# EAGLE design pedal-box-board-testing-manufactured-2016-10-21 (EAGLE 7.6.0)
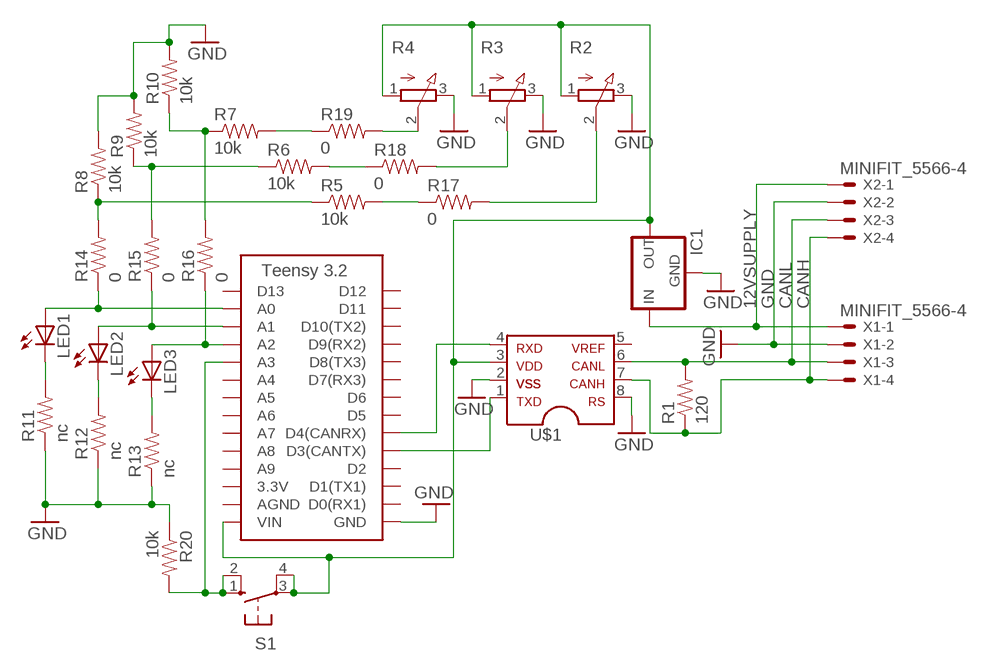
[diagram p0: schematic, sheet 1]

## Parts
IC1  5V_REGULATOR_L7805SWITCHING  [TO-220]
LED1  LED-5MM  [LED-5MM]
LED2  LED-5MM  [LED-5MM]
LED3  LED-5MM  [LED-5MM]
R1  120  RESISTORAXIAL-0.3  [AXIAL-0.3]
R2  3RP/1610N  [3RP/1610N]
R3  3RP/1610N  [3RP/1610N]
R4  3RP/1610N  [3RP/1610N]
R5  10k  RESISTOREZ  [AXIAL-0.3EZ]
R6  10k  RESISTOREZ  [AXIAL-0.3EZ]
R7  10k  RESISTOREZ  [AXIAL-0.3EZ]
R8  10k  RESISTOREZ  [AXIAL-0.3EZ]
R9  10k  RESISTOREZ  [AXIAL-0.3EZ]
R10  10k  RESISTOREZ  [AXIAL-0.3EZ]
R11  nc  RESISTOREZ  [AXIAL-0.3EZ]
R12  nc  RESISTOREZ  [AXIAL-0.3EZ]
R13  nc  RESISTOREZ  [AXIAL-0.3EZ]
R14  0  RESISTOREZ  [AXIAL-0.3EZ]
R15  0  RESISTOREZ  [AXIAL-0.3EZ]
R16  0  RESISTOREZ  [AXIAL-0.3EZ]
R17  0  RESISTOREZ  [AXIAL-0.3EZ]
R18  0  RESISTOREZ  [AXIAL-0.3EZ]
R19  0  RESISTOREZ  [AXIAL-0.3EZ]
R20  10k  RESISTOREZ  [AXIAL-0.3EZ]
S1  BTN_10-XX  [B3F-10XX]
U$1  MCP2551  [SOIC-08]
U$2  TEENSY_3.2_SIMPLE  [TEENSY_3.2_SIMPLE]
X1  MINIFIT_5566-4  [MINIFIT_5566-4]
X2  MINIFIT_5566-4  [MINIFIT_5566-4]

## Nets
12VSUPPLY: IC1.1(IN) X1.1 X2.1
CANH: R1.P$1 U$1.7 X1.4 X2.4
CANL: R1.P$2 U$1.6 X1.3 X2.3
GND: IC1.2(GND) R2.3(E) R3.3(E) R4.3(E) R8.P$2 R9.P$2 R10.P$2 R11.P$1 R12.P$1 R13.P$1 R20.P$1 U$1.2 U$1.8 U$2.GND X1.2 X2.2
N$1: R3.2(S) R18.P$2
N$2: IC1.3(OUT) R2.1(A) R3.1(A) R4.1(A) S1.3(P) S1.4(P1) U$1.3 U$2.VIN
N$3: LED3.A R16.P$1 U$2.A2
N$4: LED2.A R15.P$1 U$2.A1
N$5: U$1.1 U$2.D3(CANTX)
N$6: U$1.4 U$2.D4(CANRX)
N$7: R5.P$1 R8.P$1 R14.P$2
N$8: R2.2(S) R17.P$2
N$9: R4.2(S) R19.P$2
N$10: R7.P$1 R10.P$1 R16.P$2
N$11: LED1.K(C) R11.P$2
N$12: LED2.K(C) R12.P$2
N$13: LED3.K(C) R13.P$2
N$14: LED1.A R14.P$1 U$2.A0
N$15: R6.P$1 R9.P$1 R15.P$2
N$16: R5.P$2 R17.P$1
N$17: R7.P$2 R19.P$1
N$18: R6.P$2 R18.P$1
N$19: R20.P$2 S1.1(S) S1.2(S1) U$2.A3
Unconnected: U$1.5 U$2.3.3V U$2.A4 U$2.A5 U$2.A6 U$2.A7 U$2.A8 U$2.A9 U$2.AGND U$2.D0(RX1) U$2.D1(TX1) U$2.D2 U$2.D5 U$2.D6 U$2.D7(RX3) U$2.D8(TX3) U$2.D9(RX2) U$2.D10(TX2) U$2.D11 U$2.D12 U$2.D13

## Library data of the parts
IC1 = HyTechDevices:5V_REGULATOR_L7805: Voltage Regulator Switching 5v regulator Datasheet <http://power.murata.com/data/power/oki-78sr.pdf> Standard 7805 5V regulator. IGO (Input Ground Output). Spark Fun Electronics SKU : COM-00107 Datasheet <http://www.mouser.com/ds/2/308/MC7800-D-94905.pdf>
LED1-LED3 = HyTechDevices:LED: Light Emitting Diode Source: Dangerous Prototypes Eagle Library <https://github.com/DangerousPrototypes/Eagle_Part_Library>
R1 R5-R20 = HyTechDevices:RESISTOR: Resistor Basic schematic elements and footprints for 0603, 1206, and PTH resistors.
R2-R4 = HyTechDevices:3RP/1610N: 16mm Potentiometer one level Source: http://www.alphapotentiometers.net/html/16mm_pot_2.html
S1 = HyTechDevices:BTN_10-XX: OMRON SWITCH; MPN: B3F-1000; OC_FARNELL: 176432; OC_NEWARK: 36M3542
U$1 = HyTechDevices:MCP2551: MCP2551 High-Speed CAN Transceiver Product Webpage <https://www.microchip.com/wwwproducts/en/MCP2551> Datasheet <http://ww1.microchip.com/downloads/en/DeviceDoc/21667f.pdf> This device is outdated It is replaced by MCP2561. Comparison Page <https://www.microchip.com/wwwproducts/ProductCompare/MCP2551/MCP2561> Product Webpage <https://www.microchip.com/wwwproducts/en/MCP2561> Datasheet <http://ww1.microchip.com/downloads/en/DeviceDoc/20005167C.pdf>
U$2 = HyTechDevices:TEENSY_3.2_SIMPLE: Simple version of the Teensy 3.2 board that only uses the 2 main rows of pins, not the inner pins or the pins opposite the usb port.
X1 X2 = HyTechDevices:MINIFIT_5566-4: Mini FIT Junior connector 4 pole Source: http://www.molex.com; OC_FARNELL: unknown; OC_NEWARK: unknown

## Board
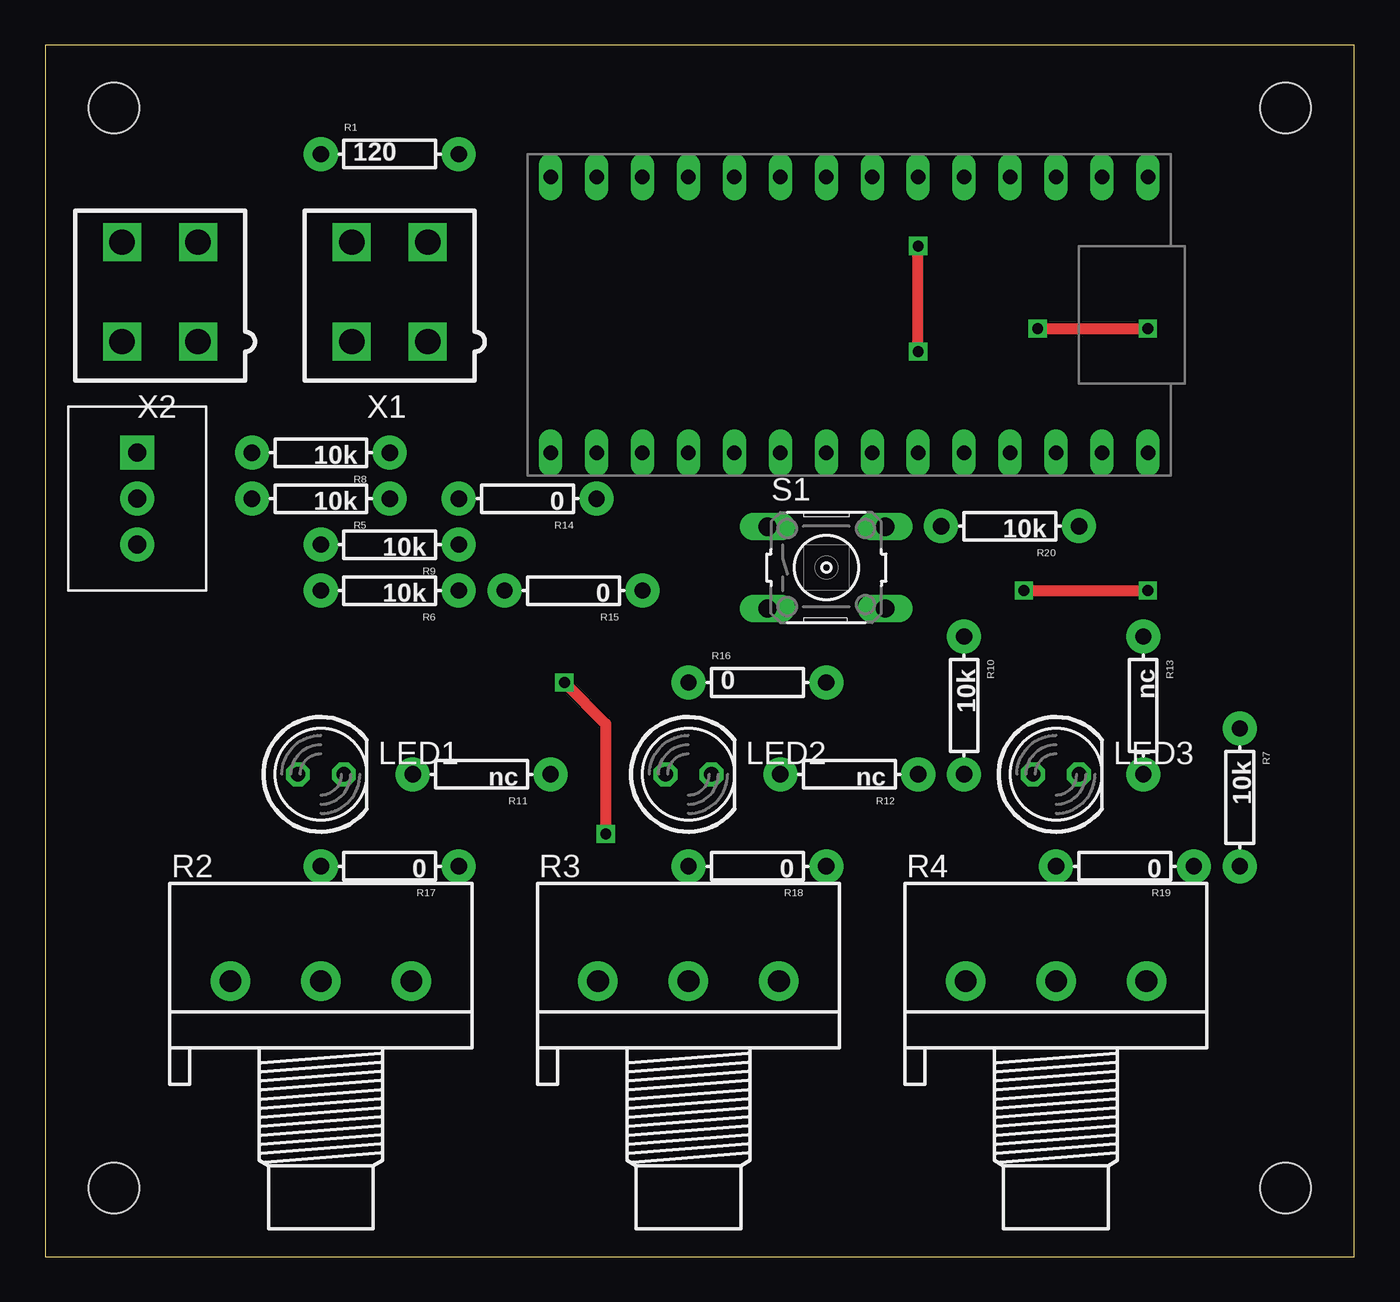
[diagram p1: board, top side]
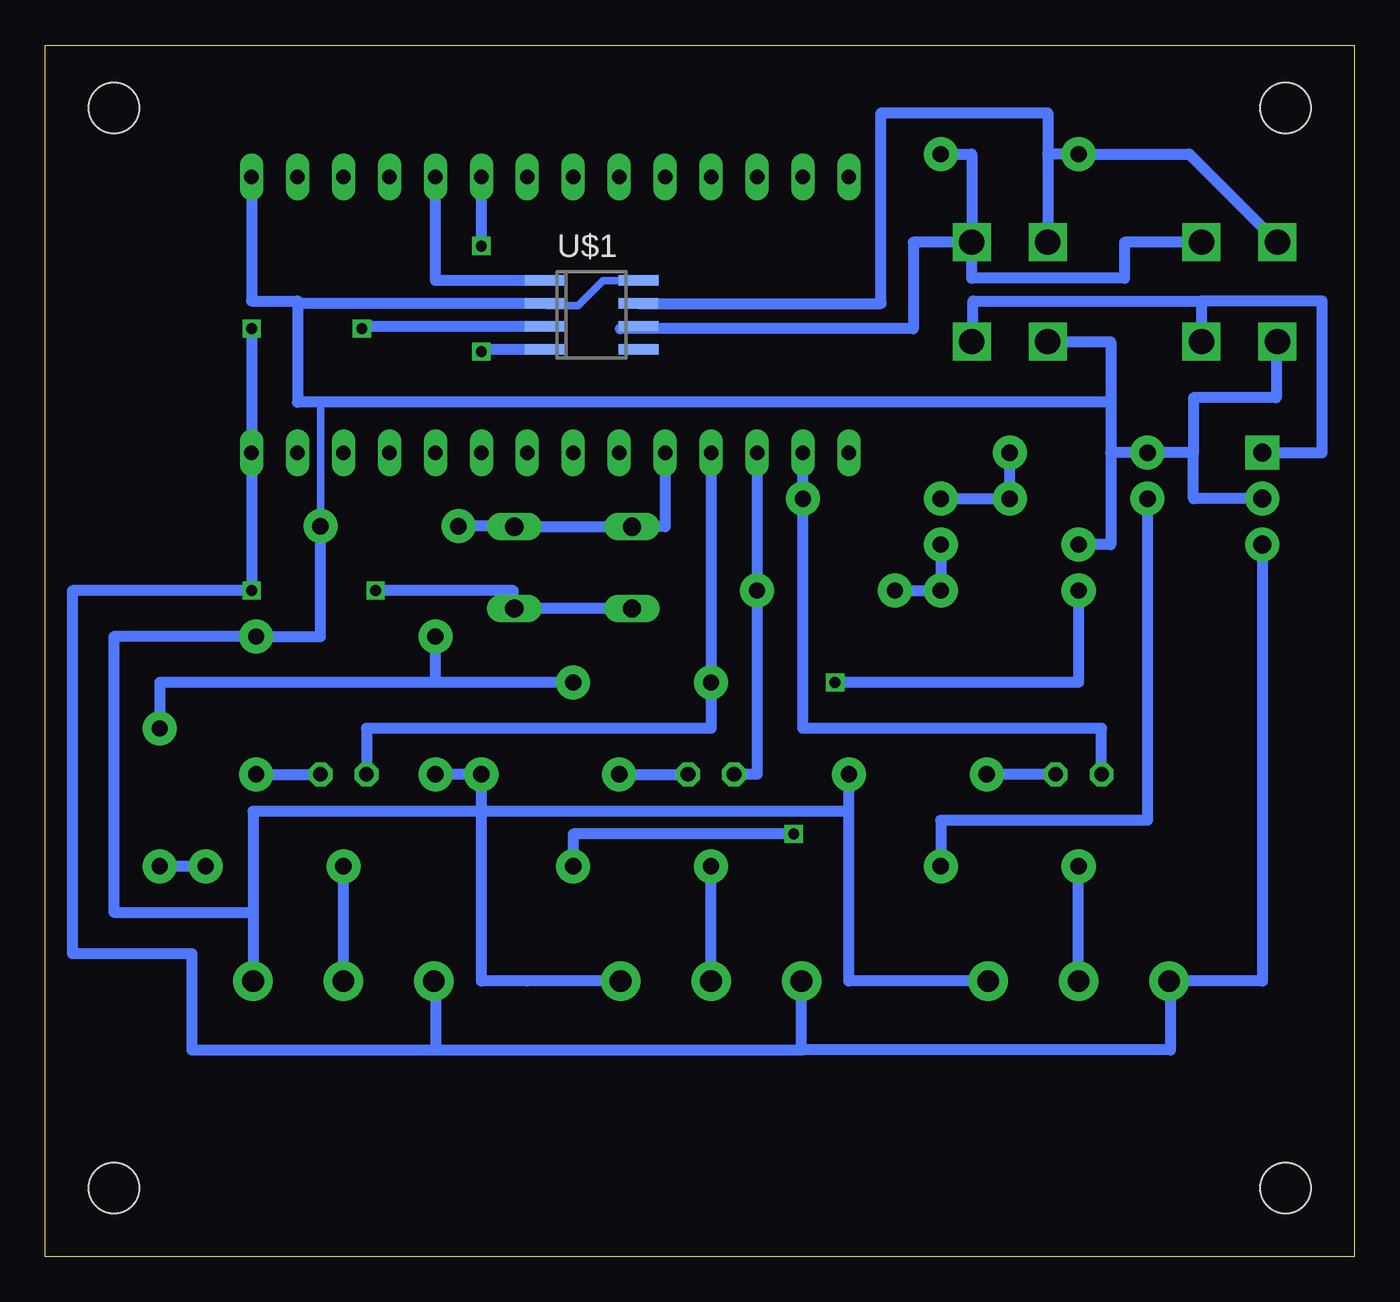
[diagram p2: board, bottom side, seen from below]

Size 72.37 x 66.98 mm. Coordinates in mm from the lower left corner, seen from the top.
Outline: 0,0 72.37,0 72.37,66.98 0,66.98 0,0
Copper layers (1*16): Top 0.035mm / dielectric 1.5mm / Bottom 0.035mm
Design rules "default": minimum track width 10mil, minimum drill 24mil, track to track 8mil, track to pad 8mil, pad to pad 8mil, via to via 8mil, smd to smd 8mil, copper to edge 40mil, drill to drill 8mil, minimum pad ring 10mil, minimum via ring 8mil, stop-mask expansion 4mil, vias tented up to drill 0mil, thermal gap 10mil
Holes 2.8 mm at 3.81,63.5 68.58,63.5 3.81,3.81 68.58,3.81

### Footprints (pad centres in the part's own frame; a part is rotated, then mirrored left to right if it is on the bottom)
TO-220 = drill 1 pad 1.88 square: 1 -2.54,0 | drill 1 pad 1.88: 2 0,0; 3 2.54,0
LED-5MM = drill 0.813 octagon: A -1.27,0; K 1.27,0
AXIAL-0.3 = drill 0.9 pad 1.88: P$1 -3.81,0; P$2 3.81,0
3RP/1610N = drill 1.2 pad 2.184: 1 -5,0; 2 0,0; 3 5,0
AXIAL-0.3EZ = drill 0.9 pad 1.88: P$1 -3.81,0; P$2 3.81,0
B3F-10XX = drill 1.016 long: 1 -3.251,2.261; 2 3.251,2.261; 3 -3.251,-2.261; 4 3.251,-2.261
SOIC-08 = smd 0.6 x 2.2: 1 -1.905,-2.6; 2 -0.635,-2.6; 3 0.635,-2.6; 4 1.905,-2.6; 5 1.905,2.6; 6 0.635,2.6; 7 -0.635,2.6; 8 -1.905,2.6
TEENSY_3.2_SIMPLE = drill 0.8 long: 3.3V 16.51,29.21; A0 16.51,3.81; A1 16.51,6.35; A2 16.51,8.89; A3 16.51,11.43; A4 16.51,13.97; A5 16.51,16.51; A6 16.51,19.05; A7 16.51,21.59; A8 16.51,24.13; A9 16.51,26.67; AGND 16.51,31.75; D0(RX1) 1.27,31.75; D1(TX1) 1.27,29.21; D2 1.27,26.67; D3(CANTX) 1.27,24.13; D4(CANRX) 1.27,21.59; D5 1.27,19.05; D6 1.27,16.51; D7(RX3) 1.27,13.97; D8(TX3) 1.27,11.43; D9(RX2) 1.27,8.89; D10(TX2) 1.27,6.35; D11 1.27,3.81; D12 1.27,1.27; D13 16.51,1.27; GND 1.27,34.29; VIN 16.51,34.29
MINIFIT_5566-4 = drill 1.4 square: 1 2.1,-2.75; 2 -2.1,-2.75; 3 2.1,2.75; 4 -2.1,2.75

### Placement (x,y rotation side)
IC1  5.08,41.91 270 top
LED1  15.24,26.67 0 top
LED2  35.56,26.67 0 top
LED3  55.88,26.67 0 top
R1  19.05,60.96 0 top
R2  15.24,15.24 0 top
R3  35.56,15.24 0 top
R4  55.88,15.24 0 top
R5  15.24,41.91 180 top
R6  19.05,36.83 180 top
R7  66.04,25.4 270 top
R8  15.24,44.45 180 top
R9  19.05,39.37 180 top
R10  50.8,30.48 270 top
R11  24.13,26.67 180 top
R12  44.45,26.67 180 top
R13  60.71,30.48 270 top
R14  26.67,41.91 180 top
R15  29.21,36.83 180 top
R16  39.37,31.75 0 top
R17  19.05,21.59 180 top
R18  39.37,21.59 180 top
R19  59.69,21.59 180 top
R20  53.34,40.39 180 top
S1  43.18,38.1 0 top
U$1  42.16,52.07 270 bottom
U$2  26.67,60.96 270 top
X1  19.05,53.34 0 top
X2  6.35,53.34 0 top

### Tracks (layer width: path | path; a pad name or v marks a point on that pad's centre or on a via)
12VSUPPLY
  Bottom 0.61: IC1.1 1.78,44.45 1.78,52.83 8.45,52.83 | 8.45,52.83 X2.1 | X1.1 21.08,50.59 21.08,52.83 8.45,52.83
CANH
  Bottom 0.61: 16.95,60.96 R1.P$1 9.12,60.96 X2.4 | 16.95,60.96 X1.4 | U$1.7 26.16,52.7 26.16,63.25 16.95,63.25 16.95,60.96
CANL
  Bottom 0.61: R1.P$2 21.15,60.96 X1.3 | X2.3 12.7,56.09 12.7,54.1 21.15,54.1 X1.3 | X1.3 24.38,56.09 24.38,51.31 40.58,51.31 U$1.6
GND
  Bottom 0.406: U$1.8 41.53,53.98 42.93,52.58 44.64,52.58 U$1.2 | R20.P$1 57.15,47.24
  Bottom 0.61: R3.3 48.26,15.24 48.26,24.64 | 48.26,24.64 60.88,24.64 60.88,19.05 | 60.88,19.05 68.58,19.05 68.58,34.29 R13.P$1 57.15,34.29 R20.P$1 | 60.88,19.05 R4.3 | R2.3 27.94,15.24 27.94,24.64 | R3.3 40.64,15.24 | R3.3 45.72,15.24 | 48.26,24.64 27.94,24.64 | IC1.2 8.89,41.91 8.89,44.45 | 8.89,44.45 R8.P$2 13.46,44.45 | 13.46,44.45 13.46,39.37 R9.P$2 | X1.2 13.46,50.59 13.46,47.24 | X2.2 4.32,50.59 4.32,47.5 8.89,47.5 8.89,44.45 | U$2.GND 60.96,52.83 58.42,52.83 58.42,52.7 | 58.42,52.7 58.42,47.24 57.15,47.24 13.46,47.24 | U$1.2 58.42,52.7 | 13.46,47.24 13.46,44.45 | 48.26,24.64 R12.P$1 R10.P$2 | 27.94,24.64 R11.P$1
N$1
  Bottom 0.61: R3.2 R18.P$2
N$2  (via drill 0.6)
  Top 0.61: v54.86,51.31 v60.96,51.31 | v54.1,36.83 v60.96,36.83
  Bottom 0.61: 30.56,11.43 10.16,11.43 10.16,15.24 R2.1 5.08,15.24 IC1.3 | 30.56,11.43 R3.1 | R4.1 50.8,15.24 50.8,11.43 | 50.8,11.43 30.56,11.43 | U$1.3 54.86,51.44 v54.86,51.31 | v60.96,51.31 U$2.VIN v60.96,36.83 70.87,36.83 70.87,16.76 64.26,16.76 64.26,11.43 50.8,11.43 | S1.3 S1.4 46.48,35.84 46.48,36.83 v54.1,36.83
N$3
  Bottom 0.61: U$2.A2 R16.P$1 35.56,30.48 35.56,29.21 54.61,29.21 LED3.A
N$4
  Bottom 0.61: LED2.A 33.02,26.67 R15.P$1 U$2.A1
N$5
  Bottom 0.61: U$1.1 50.8,53.98 U$2.D3(CANTX)
N$6  (via drill 0.6)
  Top 0.61: v48.26,50.04 v48.26,55.88
  Bottom 0.61: U$1.4 48.26,50.16 v48.26,50.04 | v48.26,55.88 U$2.D4(CANRX)
N$7
  Bottom 0.61: R14.P$2 R5.P$1 R8.P$1
N$8
  Bottom 0.61: R2.2 R17.P$2
N$9
  Bottom 0.61: R4.2 R19.P$2
N$10
  Bottom 0.61: R16.P$2 50.8,31.75 | 50.8,31.75 R10.P$1 | 50.8,31.75 66.04,31.75 R7.P$1
N$11
  Bottom 0.61: LED1.K R11.P$2
N$12
  Bottom 0.61: R12.P$2 LED2.K
N$13
  Bottom 0.61: R13.P$2 LED3.K
N$14
  Bottom 0.61: LED1.A 13.97,29.21 30.48,29.21 R14.P$1 U$2.A0
N$15
  Bottom 0.61: R9.P$1 R6.P$1 R15.P$2
N$16
  Bottom 0.61: R5.P$2 11.43,24.13 22.86,24.13 R17.P$1
N$17
  Bottom 0.61: R19.P$1 R7.P$2
N$18  (via drill 0.6)
  Top 0.61: v28.7,31.75 30.99,29.46 v30.99,23.37
  Bottom 0.61: R6.P$2 15.24,31.75 v28.7,31.75 | v30.99,23.37 43.18,23.37 R18.P$1
N$19
  Bottom 0.61: U$2.A3 38.1,40.36 S1.1 S1.2 46.43,40.39 R20.P$2